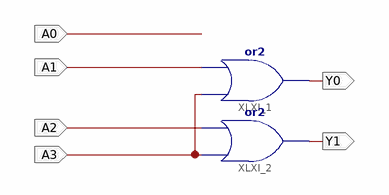
[diagram p0: schematic sheet 1]
// Xilinx ISE schematic encoder4to2.sch (spartan3e) as structural Verilog: 2 symbols, 6 ports
module encoder4to2 (
  input  A1,
  input  A2,
  input  A3,
  input  A0,
  output Y0,
  output Y1
);

  or XLXI_1 (Y0, A3, A1);
  or XLXI_2 (Y1, A3, A2);
endmodule
